# EAGLE design 02_egitim_robotu (EAGLE 9.6.2)
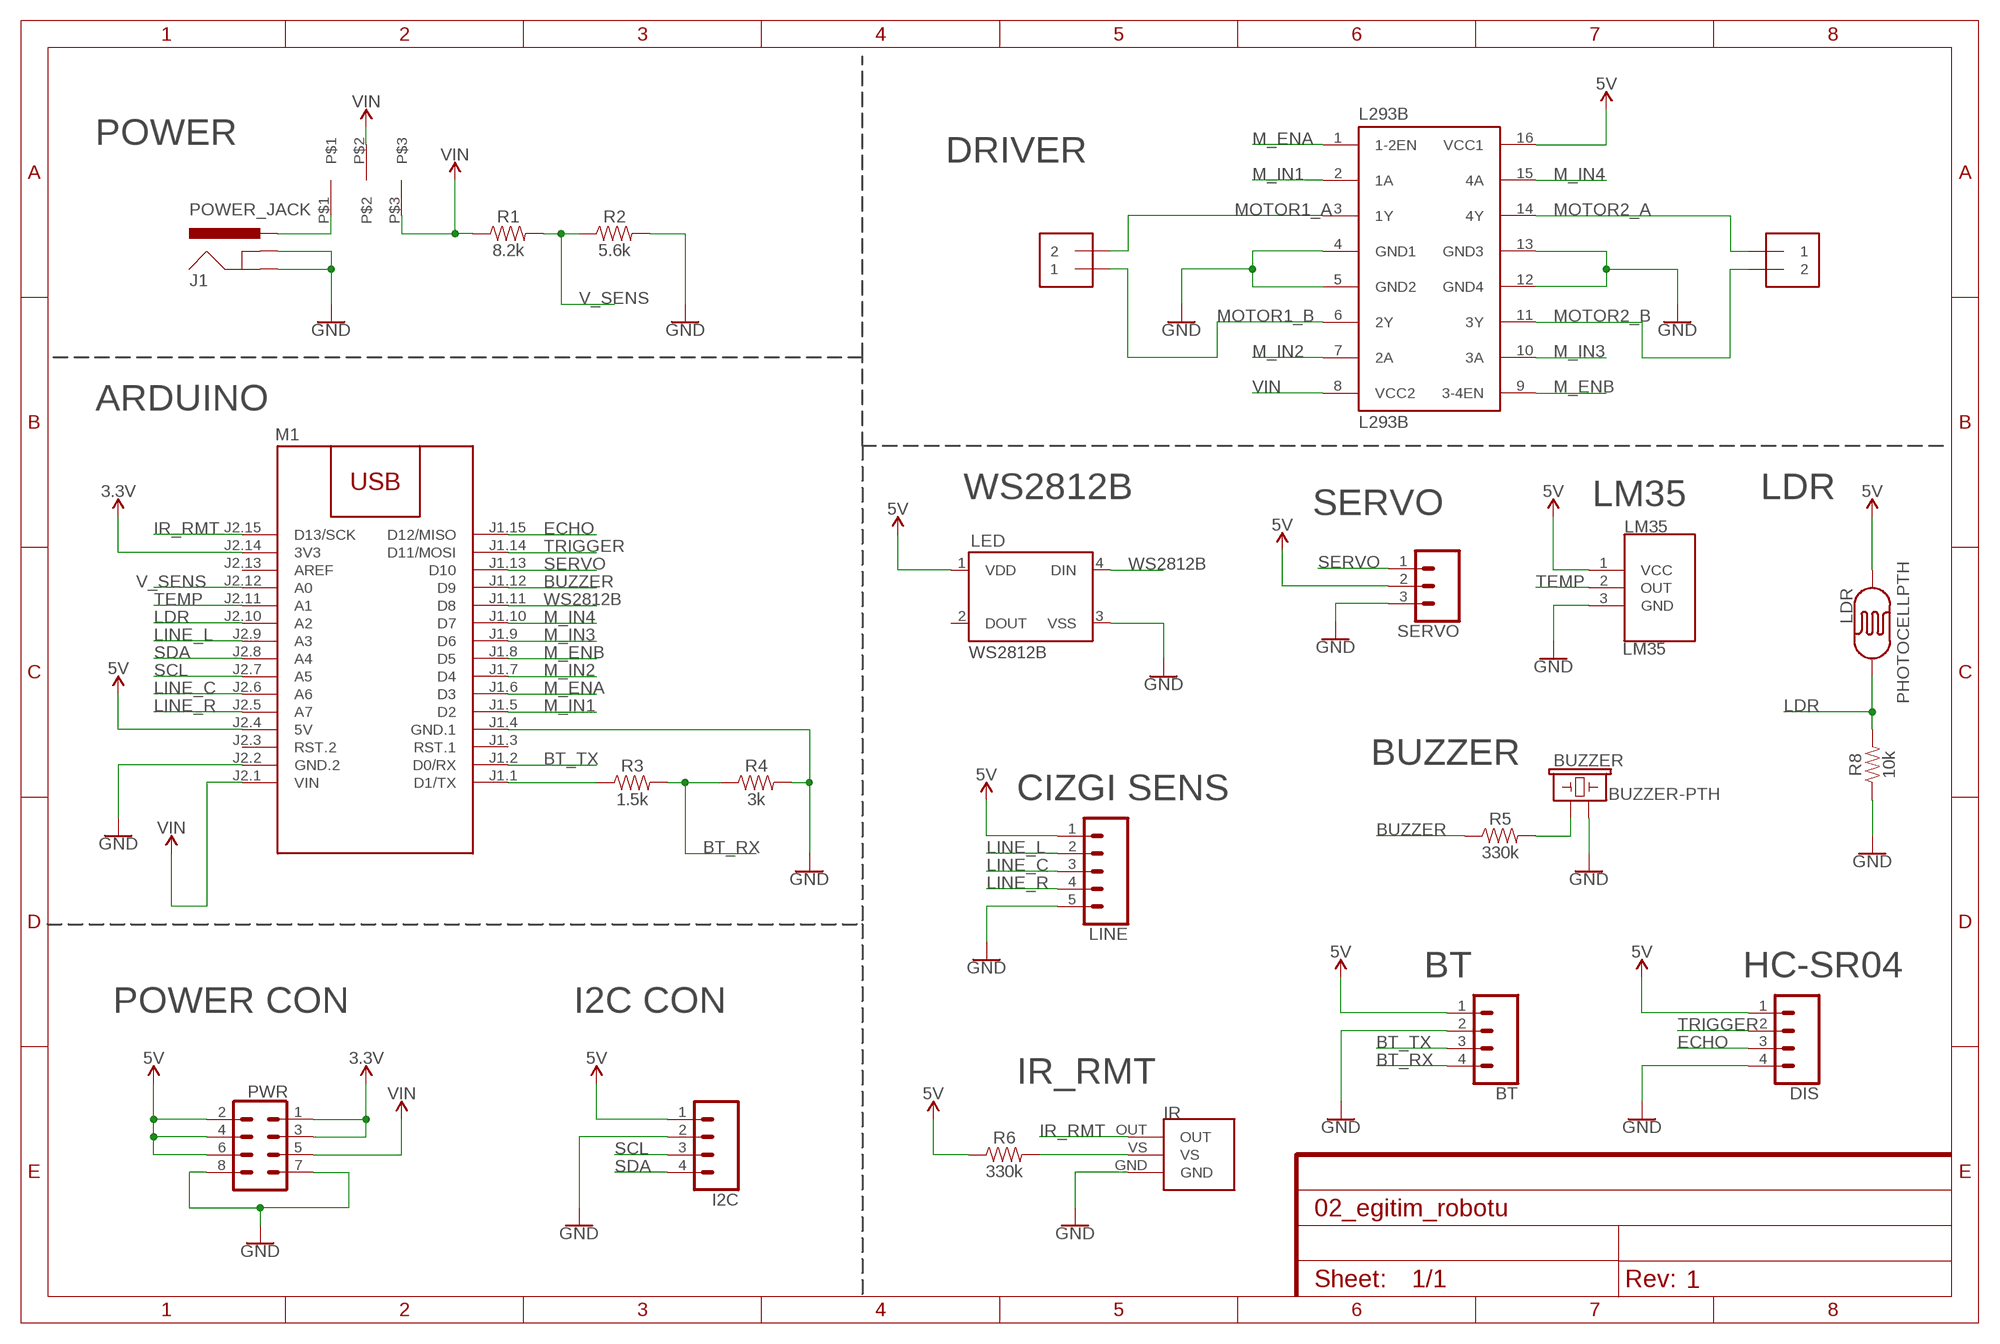
[diagram p0: schematic, sheet 1]
FRAME1 (FRAME-A4L): CREVISION: 1

## Parts
BT  CONN_04  [1X04]
BUZZER  BUZZER-PTH  [BUZZER-12MM]
DIS  CONN_04  [1X04]
I2C  CONN_04  [1X04]
IR  TSOP2238THT  [TSOP2238]
J1  POWER_JACK  [POWER_JACK_PTH]
L293B  L293B  L293D  [DIL16]
LDR  PHOTOCELLPTH  [PHOTOCELL]
LED  WS2812B  [WS2812B]
LINE  CONN_05  [1X05]
LM35  LM35  [TO-92]
M1  ARDUINO-NANO  [ARDUINO-NANO]
MPW1  1X2-3.5MM  [1X2-3.5MM]
MPW2  1X2-3.5MM  [1X2-3.5MM]
PWR  CONN_04X2  [2X4]
R1  8.2k  1KOHM-HORIZ-1/4W-5%  [AXIAL-0.3]
R2  5.6k  1KOHM-HORIZ-1/4W-5%  [AXIAL-0.3]
R3  1.5k  1KOHM-HORIZ-1/4W-5%  [AXIAL-0.3]
R4  3k  1KOHM-HORIZ-1/4W-5%  [AXIAL-0.3]
R5  330k  1KOHM-HORIZ-1/4W-5%  [AXIAL-0.3]
R6  330k  1KOHM-HORIZ-1/4W-5%  [AXIAL-0.3]
R8  10k  1KOHM-HORIZ-1/4W-5%  [AXIAL-0.3]
SERVO  CONN_03  [1X03]
SW1  SURGULU_SIVIC  [SURGULU_SIVIC]

## Nets
3.3V: M1.J2.14(3V3) PWR.1 PWR.3
5V: BT.1 DIS.1 I2C.1 L293B.16(VCC1) LDR.1 LED.1(VDD) LINE.1 LM35.1(VCC) M1.J2.4(5V) PWR.2 PWR.4 PWR.6 R6.P$1 SERVO.2
ARD_TX: M1.J1.1(D1/TX) R3.P$1
BT_RX: BT.4 R3.P$2 R4.P$1
BT_TX: BT.3 M1.J1.2(D0/RX)
BUZZER: M1.J1.12(D9) R5.P$1
ECHO: DIS.3 M1.J1.15(D12/MISO)
GND: BT.2 BUZZER.- DIS.4 I2C.2 IR.GND J1.GND J1.GNDBREAK L293B.4(GND1) L293B.5(GND2) L293B.12(GND4) L293B.13(GND3) LED.3(VSS) LINE.5 LM35.3(GND) M1.J1.4(GND.1) M1.J2.2(GND.2) PWR.7 PWR.8 R2.P$2 R4.P$2 R8.P$1 SERVO.3
IR_RMT: IR.OUT M1.J2.15(D13/SCK)
LDR: LDR.2 M1.J2.10(A2) R8.P$2
LINE_C: LINE.3 M1.J2.6(A6)
LINE_L: LINE.2 M1.J2.9(A3)
LINE_R: LINE.4 M1.J2.5(A7)
M_ENA: L293B.1(1-2EN) M1.J1.6(D3)
M_ENB: L293B.9(3-4EN) M1.J1.8(D5)
M_IN1: L293B.2(1A) M1.J1.5(D2)
M_IN2: L293B.7(2A) M1.J1.7(D4)
M_IN3: L293B.10(3A) M1.J1.9(D6)
M_IN4: L293B.15(4A) M1.J1.10(D7)
MOTOR1_A: L293B.3(1Y) MPW1.2
MOTOR1_B: L293B.6(2Y) MPW1.1
MOTOR2_A: L293B.14(4Y) MPW2.1
MOTOR2_B: L293B.11(3Y) MPW2.2
N$1: BUZZER.+ R5.P$2
N$2: IR.VS R6.P$2
N$3: J1.PWR SW1.P$1
SCL: I2C.3 M1.J2.7(A5)
SDA: I2C.4 M1.J2.8(A4)
SERVO: M1.J1.13(D10) SERVO.1
TEMP: LM35.2(OUT) M1.J2.11(A1)
TRIGGER: DIS.2 M1.J1.14(D11/MOSI)
V_SENS: M1.J2.12(A0) R1.P$2 R2.P$1
VIN: L293B.8(VCC2) M1.J2.1(VIN) PWR.5 R1.P$1 SW1.P$2 SW1.P$3
WS2812B: LED.4(DIN) M1.J1.11(D8)
Unconnected: LED.2(DOUT) M1.J1.3(RST.1) M1.J2.3(RST.2) M1.J2.13(AREF)

## Notes on the sheet
- POWER
- DRIVER
- ARDUINO
- WS2812B | LM35 | LDR
- SERVO
- BUZZER
- CIZGI SENS
- BT | HC-SR04
- POWER CON | I2C CON
- IR_RMT

## Library data of the parts
BT DIS I2C = SparkFun-Connectors:CONN_04: Multi connection point. Often used as Generic Header-pin footprint for 0.1 inch spaced/style header connections On any of the 0.1 inch spaced packages, you can populate with these: Break Away Headers - Straight <https://www.sparkfun.com/products/116> (PRT-00116) Break Away Male Headers - Right Angle <https://www.sparkfun.com/products/553> (PRT-00553) Female Headers <https://www.sparkfun.com/products/115> (PRT-00115) Break Away Headers - Machine Pin <https://www.sparkfun.com/products/117> (PRT-00117) Break Away Female Headers - Swiss Machine Pin <https://www.sparkfun.com/products/743> (PRT-00743) For SCREWTERMINALS and SPRING TERMINALS visit here: Screw Terimnals on SparkFun.com <https://www.sparkfun.com/search/results?term=Screw+Terminals> (5mm/3.5mm/2.54mm spacing) This device is also useful as a general connection point to wire up your design to another part of your project. Our various solder wires solder well into these plated through hole pads. Hook-Up Wire - Assortment (Stranded, 22 AWG) <https://www.sparkfun.com/products/11375> (PRT-11375) Hook-Up Wire - Assortment (Solid Core, 22 AWG) <https://www.sparkfun.com/products/11367> (PRT-11367) View the entire wire category on our website here <https://www.sparkfun.com/categories/141> Special notes: Molex polarized connector foot print use with SKU : PRT-08231 with associated crimp pins and housings. 1MM SMD Version SKU: PRT-10208; PROD_ID: CONN-09696
BUZZER = SparkFun-Electromechanical:BUZZER: Buzzer Small round buzzers that operate around the audible 2kHz range. You can use these as speakers to create simple music or user interfaces. Variant Overview: PTH - Mini Speaker - PC Mount 12mm 2.048kHz <https://www.sparkfun.com/products/7950> PTH_KIT - Mini Speaker - PC Mount 12mm 2.048kHz <https://www.sparkfun.com/products/7950> KIT simplifies soldering by adding stop mask to one side of the pads. PTH_NO_SILK - Mini Speaker - PC Mount 12mm 2.048kHz <https://www.sparkfun.com/products/7950> No silkscreen indicator of buzzer outline. PTH_KIT_NO_SILK - Mini Speaker - PC Mount 12mm 2.048kHz <https://www.sparkfun.com/products/7950> KIT package w/o silkscreen SMD - Buzzer Audio Magnetic (CCV-084B16) SMD buzzer used on, e.g. the LilyPad Buzzer <https://www.sparkfun.com/products/8463> and RFID USB Reader <https://www.sparkfun.com/products/9963>. SMD_KIT - Buzzer Audio Magnetic (CCV-084B16) SMD Buzzer with elongated pins to make soldering easier. Used on the SparkFun Simon Says - Surface Mount Soldering Kit <https://www.sparkfun.com/products/10935>.; PROD_ID: COMP-08253; SF_SKU: COM-07950
IR = OmerFarukUcar-Sensors:TSOP2238: TSOP2238 Device Created Date: 12.02.2020 Datasheet: https://cdn.ozdisan.com/ETicaret_Dosya/38875_1350615.pdf
J1 = SparkFun-Connectors:POWER_JACK: Power Jack Connector This is the standard 5.5mm barrel jack for power. The PTH is the most common, proven, reliable, footprint. The Slot footprint only works if the mill layer is transmitted to the PCB fab house so be warned. Here are the connectors we sell at SparkFun: DC Barrel Power Jack/Connector <https://www.sparkfun.com/products/119> (PRT-00119) DC Barrel Power Jack/Connector (SMD) <https://www.sparkfun.com/products/12748> (PRT-12748) DC Barrel Jack Adapter - Breadboard Compatible <https://www.sparkfun.com/products/10811> (PRT-10811) It is used on this SparkFun product (and many, many others): SparkFun RedBoard - Programmed with Arduino <https://www.sparkfun.com/products/12757> (DEV-12757) Also, if you need a mating power supply or connector, please check these out: Wall Adapter Power Supply - 9VDC 650mA <https://www.sparkfun.com/products/298> (TOL-00298) DC Barrel Jack Adapter - Male <https://www.sparkfun.com/products/10287> (PRT-10287); PROD_ID: CONN-08197
L293B = st-microelectronics:L293D: PUSH-PULL 4 CHANNEL DRIVER; MPN: L293D; OC_FARNELL: 9589619; OC_NEWARK: 56P8249
LDR = SparkFun:PHOTOCELL: Photocell Also known as a CdS photoresistor. This is a low cost way to detect light levels. Resistance decreases with more incoming light. SparkFun SKU: SEN-09088
LED = SparkFun-LED:WS2812B: WS2812B - Intelligent control LED integrated light source Technical Specifications: Power Supply Voltage (VDD): 3.5 to 5.3 V Input Voltage (VI): -0.5 to VDD+0.5 V Operating Junction Temperature (Topt): -25°C to +80°C Storage Temperature Range (Tstg): -55°C to +150°C; PROD_ID: DIO-12503
LINE = SparkFun-Connectors:CONN_05: Multi connection point. Often used as Generic Header-pin footprint for 0.1 inch spaced/style header connections On any of the 0.1 inch spaced packages, you can populate with these: Break Away Headers - Straight <https://www.sparkfun.com/products/116> (PRT-00116) Break Away Male Headers - Right Angle <https://www.sparkfun.com/products/553> (PRT-00553) Female Headers <https://www.sparkfun.com/products/115> (PRT-00115) Break Away Headers - Machine Pin <https://www.sparkfun.com/products/117> (PRT-00117) Break Away Female Headers - Swiss Machine Pin <https://www.sparkfun.com/products/743> (PRT-00743) For SCREWTERMINALS and SPRING TERMINALS visit here: Screw Terimnals on SparkFun.com <https://www.sparkfun.com/search/results?term=Screw+Terminals> (5mm/3.5mm/2.54mm spacing) This device is also useful as a general connection point to wire up your design to another part of your project. Our various solder wires solder well into these plated through hole pads. Hook-Up Wire - Assortment (Stranded, 22 AWG) <https://www.sparkfun.com/products/11375> (PRT-11375) Hook-Up Wire - Assortment (Solid Core, 22 AWG) <https://www.sparkfun.com/products/11367> (PRT-11367) View the entire wire category on our website here <https://www.sparkfun.com/categories/141> Special notes: Molex polarized connector foot print use with SKU : PRT-08231 with associated crimp pins and housings. 1MM SMD Version SKU: PRT-10208
LM35 = ArduinoModelleri:LM35
M1 = OmerFaruk-CPUBoards:ARDUINO-NANO: Arduino Nano 3.0
MPW1 MPW2 = adafruit:1X2: 3.5mm Terminal block http://www.ladyada.net/library/pcb/eaglelibrary.html
PWR = SparkFun-Connectors:CONN_04X2: Multi connection point. Often used as Generic Header-pin footprint for 0.1 inch spaced/style header connections On any of the 0.1 inch spaced packages, you can populate with these: Break Away Headers - Straight <https://www.sparkfun.com/products/116> (PRT-00116) Break Away Male Headers - Right Angle <https://www.sparkfun.com/products/553> (PRT-00553) Female Headers <https://www.sparkfun.com/products/115> (PRT-00115) Break Away Headers - Machine Pin <https://www.sparkfun.com/products/117> (PRT-00117) Break Away Female Headers - Swiss Machine Pin <https://www.sparkfun.com/products/743> (PRT-00743)
R1-R6 R8 = SparkFun-Resistors:1KOHM: 1kΩ resistor A resistor is a passive two-terminal electrical component that implements electrical resistance as a circuit element. Resistors act to reduce current flow, and, at the same time, act to lower voltage levels within circuits. - Wikipedia; PROD_ID: RES-08380; VALUE: 1k
SERVO = SparkFun-Connectors:CONN_03: Multi connection point. Often used as Generic Header-pin footprint for 0.1 inch spaced/style header connections On any of the 0.1 inch spaced packages, you can populate with these: Break Away Headers - Straight <https://www.sparkfun.com/products/116> (PRT-00116) Break Away Male Headers - Right Angle <https://www.sparkfun.com/products/553> (PRT-00553) Female Headers <https://www.sparkfun.com/products/115> (PRT-00115) Break Away Headers - Machine Pin <https://www.sparkfun.com/products/117> (PRT-00117) Break Away Female Headers - Swiss Machine Pin <https://www.sparkfun.com/products/743> (PRT-00743) Stackable Header - 3 Pin (Female, 0.1") <https://www.sparkfun.com/products/13875> (PRT-13875) For SCREWTERMINALS and SPRING TERMINALS visit here: Screw Terimnals on SparkFun.com <https://www.sparkfun.com/search/results?term=Screw+Terminals> (5mm/3.5mm/2.54mm spacing) This device is also useful as a general connection point to wire up your design to another part of your project. Our various solder wires solder well into these plated through hole pads. Hook-Up Wire - Assortment (Stranded, 22 AWG) <https://www.sparkfun.com/products/11375> (PRT-11375) Hook-Up Wire - Assortment (Solid Core, 22 AWG) <https://www.sparkfun.com/products/11367> (PRT-11367) View the entire wire category on our website here <https://www.sparkfun.com/categories/141> Special notes: Molex polarized connector foot print use with SKU : PRT-08232 with associated crimp pins and housings.
SW1 = Komponentler:SURGULU_SIVIC

## Board
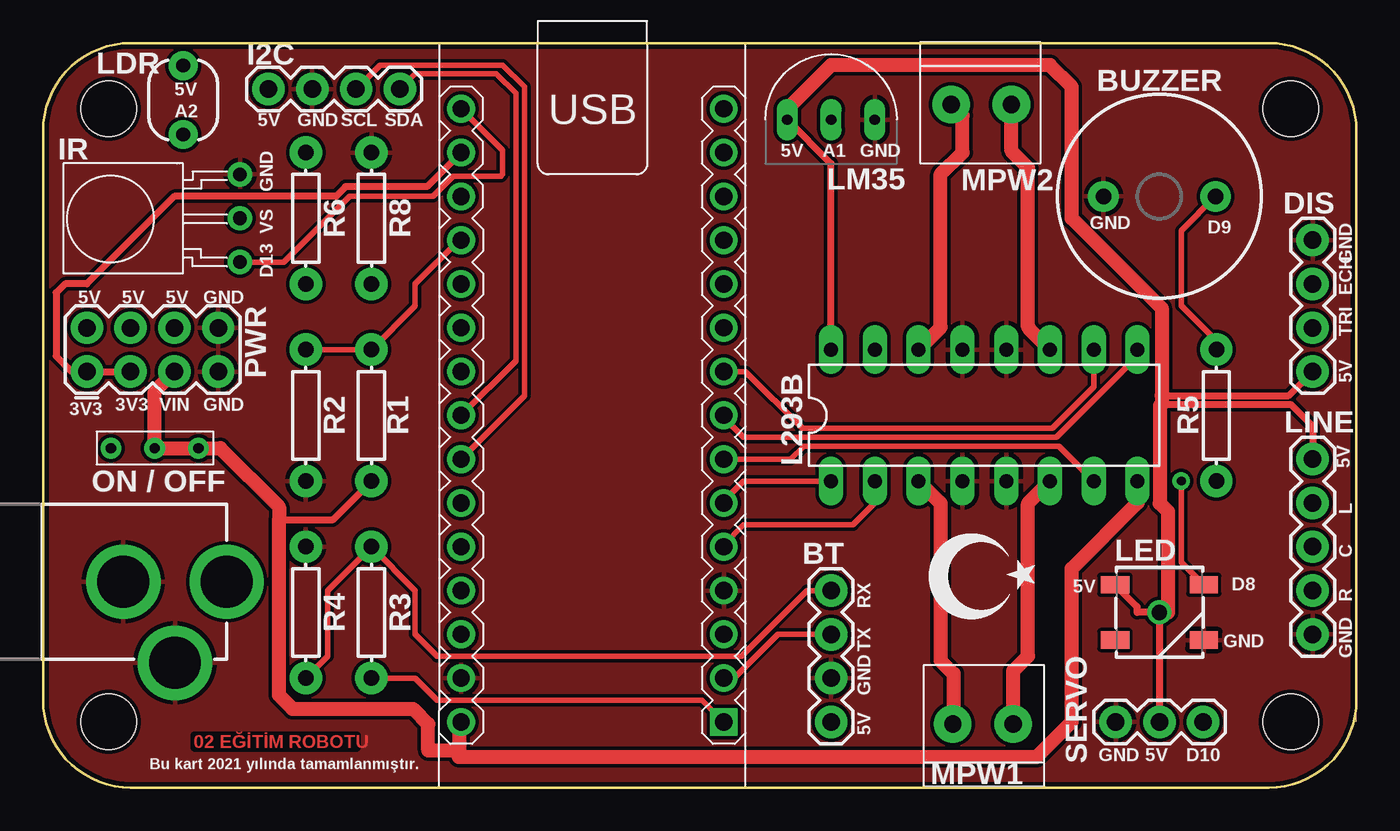
[diagram p1: board, top side]
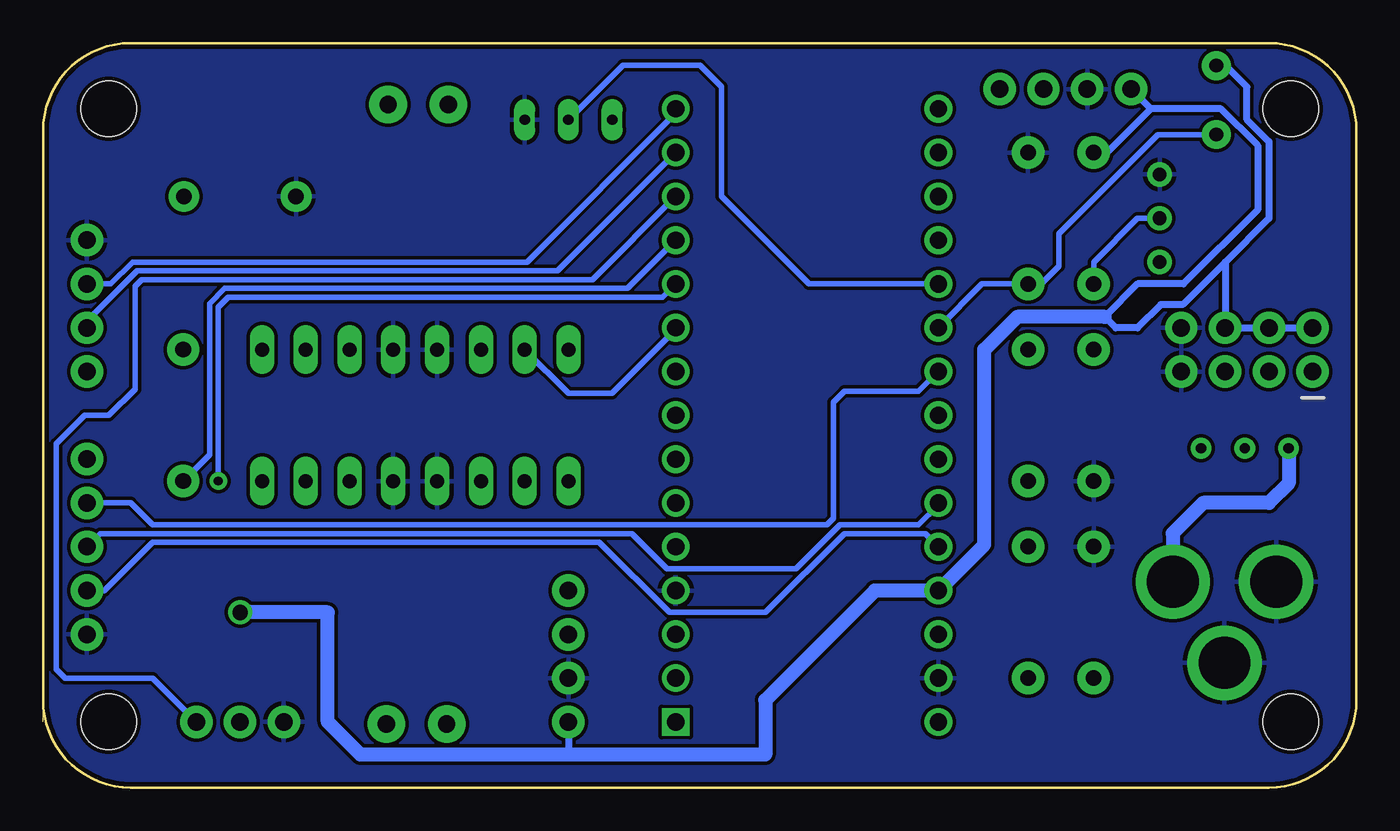
[diagram p2: board, bottom side, seen from below]

Size 76.2 x 43.18 mm. Coordinates in mm from the lower left corner, seen from the top.
Outline: 76.2,38.1 arc90 71.12,43.18
Outline: 5.08,43.18 arc90 0,38.1
Outline: 0,5.08 arc90 5.08,0
Outline: 71.12,0 arc90 76.2,5.08
Outline: 76.2,3.81 76.2,38.1
Outline: 76.2,5.08 76.2,38.1
Outline: 76.2,38.1 arc90 71.12,43.18
Outline: 71.12,43.18 5.08,43.18
Outline: 5.08,43.18 arc90 0,38.1
Outline: 0,38.1 0,5.08
Outline: 0,5.08 arc90 5.08,0
Outline: 5.08,0 71.12,0
Outline: 71.12,0 arc90 76.2,5.08
Copper layers (1*16): Top 0.035mm / dielectric 1.5mm / Bottom 0.035mm
Design rules "SparkFun": minimum track width 8mil, minimum drill 20mil, track to track 8mil, track to pad 8mil, pad to pad 8mil, via to via 8mil, smd to smd 8mil, copper to edge 10mil, drill to drill 8mil, minimum pad ring 12mil, minimum via ring 10mil, stop-mask expansion 4mil, vias tented up to drill 25mil, thermal gap 10mil
Holes 3.2 mm at 3.81,39.37 3.81,3.81 72.39,3.81 72.39,39.37

### Footprints (pad centres in the part's own frame; a part is rotated, then mirrored left to right if it is on the bottom)
1X04 = drill 1.016 pad 1.88: 1 0,0; 2 2.54,0; 3 5.08,0; 4 7.62,0
BUZZER-12MM = drill 0.9 pad 1.778: + 3.25,0; - -3.25,0
TSOP2238 = drill 0.8: GND 2.54,-7.61; OUT -2.54,-7.61; VS 0,-7.61
POWER_JACK_PTH = drill 2.997 pad 4.318: GND 0,7.7; GNDBREAK 4.7,10.7; PWR 0,13.7
DIL16 = drill 0.813 long: 1 -8.89,-3.81; 2 -6.35,-3.81; 3 -3.81,-3.81; 4 -1.27,-3.81; 5 1.27,-3.81; 6 3.81,-3.81; 7 6.35,-3.81; 8 8.89,-3.81; 9 8.89,3.81; 10 6.35,3.81; 11 3.81,3.81; 12 1.27,3.81; 13 -1.27,3.81; 14 -3.81,3.81; 15 -6.35,3.81; 16 -8.89,3.81
PHOTOCELL = drill 0.8 pad 1.676: 1 -2,0; 2 2,0
WS2812B = smd 1.651 x 1: 1 -2.577,1.6; 2 -2.577,-1.6; 3 2.577,-1.6; 4 2.577,1.6
1X05 = drill 1.016 pad 1.88: 1 0,0; 2 2.54,0; 3 5.08,0; 4 7.62,0; 5 10.16,0
TO-92 = drill 0.6 long: 1 1.27,0; 2 3.81,0; 3 6.35,0
ARDUINO-NANO = drill 1 square: J1.1 17.78,7.62 | drill 1: J1.2 15.24,7.62; J1.3 12.7,7.62; J1.4 10.16,7.62; J1.5 7.62,7.62; J1.6 5.08,7.62; J1.7 2.54,7.62; J1.8 0,7.62; J1.9 -2.54,7.62; J1.10 -5.08,7.62; J1.11 -7.62,7.62; J1.12 -10.16,7.62; J1.13 -12.7,7.62; J1.14 -15.24,7.62; J1.15 -17.78,7.62; J2.1 17.78,-7.62; J2.2 15.24,-7.62; J2.3 12.7,-7.62; J2.4 10.16,-7.62; J2.5 7.62,-7.62; J2.6 5.08,-7.62; J2.7 2.54,-7.62; J2.8 0,-7.62; J2.9 -2.54,-7.62; J2.10 -5.08,-7.62; J2.11 -7.62,-7.62; J2.12 -10.16,-7.62; J2.13 -12.7,-7.62; J2.14 -15.24,-7.62; J2.15 -17.78,-7.62
1X2-3.5MM = drill 1 pad 2.184: 1 1.8,0; 2 -1.7,0
2X4 = drill 1.016 pad 1.88: 1 -3.81,-1.27; 2 -3.81,1.27; 3 -1.27,-1.27; 4 -1.27,1.27; 5 1.27,-1.27; 6 1.27,1.27; 7 3.81,-1.27; 8 3.81,1.27
AXIAL-0.3 = drill 0.9 pad 1.88: P$1 -3.81,0; P$2 3.81,0
1X03 = drill 1.016 pad 1.88: 1 0,0; 2 2.54,0; 3 5.08,0
SURGULU_SIVIC = drill 0.6: P$1 -10.16,2.54; P$2 -7.62,2.54; P$3 -5.08,2.54

### Placement (x,y rotation side)
BT  45.72,3.81 90 top
BUZZER  64.77,34.29 0 top
DIS  73.66,24.13 90 top
I2C  13.08,40.51 0 top
IR  3.81,33.02 90 top
J1  -3.05,11.94 270 top
L293B  54.61,21.59 0 top
LDR  8.13,39.88 270 top
LED  64.77,10.16 0 top
LINE  73.66,19.05 270 top
LM35  41.91,38.73 0 top
M1  31.88,21.59 270 top
MPW1  54.48,3.68 0 top
MPW2  54.48,39.62 180 top
PWR  6.35,25.4 0 top
R1  19.05,21.59 90 top
R2  15.24,21.59 270 top
R3  19.05,10.16 90 top
R4  15.24,10.16 90 top
R5  68.07,21.59 90 top
R6  15.24,33.02 270 top
R8  19.05,33.02 270 top
SERVO  67.31,3.81 180 top
SW1  14.1,17.14 0 top
U$9  [TR_MINI]  50.21,9.21 0 top

### Tracks (layer width: path | path; a pad name or v marks a point on that pad's centre or on a via)
3.3V
  Top 0.406: M1.J2.14 22.28,34.85 17.55,34.85 16.99,34.29 7.62,34.29 2.54,29.21 1.27,29.21 0.76,28.7 0.76,25.02 1.65,24.13 PWR.1 PWR.3
5V  (via drill 0.89)
  Top 0.406: LED.1 63.46,10.49 63.46,10.16 v64.77,10.16 SERVO.2 | L293B.16 45.72,36.2 LM35.1 | LINE.1 73.66,20.96 72.39,22.23 64.9,22.23 | 64.9,22.73 72.26,22.73 DIS.1
  Top 0.813: 64.9,10.16 v64.77,10.16 65.28,10.16 65.28,16 64.79,16.49 64.82,16.52 64.82,22.15 64.9,22.23 64.9,22.73 64.9,27.81 59.69,33.02 59.69,40.64 58.42,41.91 45.72,41.91 43.18,39.37 LM35.1
  Bottom 0.406: BT.1 45.72,1.9 | LDR.1 7.59,41.88 6.35,40.64 6.35,38.73 5.08,37.46 5.08,33.02 7.62,30.48 | I2C.1 11.94,39.37 | 11.94,39.37 7.86,39.37 5.73,37.24 5.73,33.51 10.03,29.21 12.7,29.21 14.6,27.3 13.97,26.67 12.7,26.67 11.35,28.02 10.08,28.02 7.62,30.48 | 11.94,39.37 14.48,36.83 R6.P$1 | 7.62,30.48 PWR.6 PWR.4 PWR.2
  Bottom 0.813: v64.77,10.16 59.69,10.16 59.69,3.81 57.79,1.9 45.72,1.9 34.29,1.9 34.29,5.08 27.94,11.43 M1.J2.4 21.59,14.1 21.59,25.4 19.68,27.3 14.6,27.3
ARD_TX
  Top 0.305: R3.P$1 21.59,6.35 22.86,5.08 38.23,5.08 M1.J1.1
BT_RX
  Top 0.305: R4.P$1 16.51,7.62 16.51,11.43 R3.P$2 21.59,11.43 21.59,8.89 22.86,7.62 40.51,7.62 44.32,11.43 BT.4
BT_TX
  Top 0.305: M1.J1.2 40.09,6.35 42.63,8.89 BT.3
BUZZER
  Bottom 0.305: R5.P$1 66.55,19.3 66.55,28.07 65.66,28.96 42.29,28.96 M1.J1.12
ECHO
  Bottom 0.305: DIS.3 72.26,29.21 70.99,30.48 48.13,30.48 39.5,39.12 M1.J1.15
GND
  pour Top: -3.81,45.72 -3.81,-2.54 78.74,-2.54 78.74,0 78.74,45.72
  pour Bottom: -6.35,48.26 -6.35,-5.08 81.28,-5.08 81.28,48.26
IR_RMT
  Top 0.305: IR.OUT 13.97,30.48 17.78,34.29 22.62,34.29 23.78,35.45 26.56,35.45 26.67,35.56 26.67,36.96 M1.J2.15
LDR
  Bottom 0.305: M1.J2.10 21.72,29.21 R8.P$2 18.29,29.21 17.27,30.23 17.27,32.13 11.52,37.88 LDR.2
LINE_C
  Bottom 0.305: LINE.3 72.9,14.73 42.03,14.73 39.99,12.7 32.51,12.7 29.97,15.24 25.4,15.24 24.26,16.38 M1.J2.6
LINE_L
  Bottom 0.305: LINE.2 71.12,16.51 69.85,15.24 30.73,15.24 30.35,15.62 30.35,22.35 29.72,22.99 25.4,22.99 M1.J2.9
LINE_R
  Bottom 0.305: LINE.4 72.64,11.43 69.85,14.22 43.93,14.22 39.87,10.16 34.29,10.16 29.72,14.73 25.02,14.73 M1.J2.5
M_ENA
  Top 0.305: L293B.1 40.64,17.78 39.5,16.64 M1.J1.6
M_ENB
  Top 0.305: L293B.9 63.5,25.02 58.8,20.32 40.64,20.32 39.5,21.46 M1.J1.8
M_IN1
  Top 0.305: L293B.2 48.26,16.51 46.99,15.24 45.72,15.24 | 45.72,15.24 40.64,15.24 39.5,14.1 M1.J1.5 | 45.72,15.24
M_IN2
  Top 0.305: M1.J1.7 43.37,19.05 44.13,19.81 58.93,19.81 L293B.7
M_IN3
  Top 0.305: L293B.10 60.96,23.24 58.55,20.83 44.07,20.83 40.77,24.13 M1.J1.9
M_IN4
  Bottom 0.305: M1.J1.10 39.5,26.54 43.18,22.86 45.72,22.86 L293B.15
MOTOR1_A
  Top 0.813: L293B.3 52.02,16.56 52.02,16.52 52.07,16.47 52.07,7.37 52.83,6.6 52.83,3.73 MPW1.2
MOTOR1_B
  Top 0.813: MPW1.1 56.28,6.75 57.15,7.62 57.15,16.47 57.2,16.52 57.2,16.56 L293B.6
MOTOR2_A
  Top 0.813: L293B.14 52.02,26.62 52.02,26.66 52.05,26.69 52.07,26.71 52.07,35.56 53.34,36.83 53.34,38.97 MPW2.1
MOTOR2_B
  Top 0.813: L293B.11 57.2,26.62 57.2,26.66 57.15,26.71 57.15,35.94 56.18,36.91 MPW2.2
N$1
  Top 0.305: BUZZER.+ 66.04,32.31 66.04,27.94 67.94,26.04
  Top 0.406: 67.94,26.04 68.07,26.04 R5.P$2
N$2
  Bottom 0.305: IR.VS 12.7,33.02 15.24,30.48 R6.P$2
N$3
  Bottom 0.813: SW1.P$1 3.94,17.65 5.08,16.51 8.89,16.51 10.65,14.75 J1.PWR
SCL
  Top 0.305: M1.J2.7 27.94,22.73 27.94,40.64 26.67,41.91 19.56,41.91 I2C.3
SDA
  Top 0.305: M1.J2.8 27.43,24.77 27.43,40.26 26.29,41.4 21.59,41.4 I2C.4
SERVO
  Bottom 0.305: SERVO.1 69.85,6.35 74.93,6.35 75.44,6.86 75.44,19.94 73.79,21.59 72.39,21.59 70.87,23.11 70.87,29.08 70.49,29.46 44.32,29.46 M1.J1.13
TEMP
  Bottom 0.305: M1.J2.11 31.75,29.21 36.83,34.29 36.83,40.64 38.1,41.91 42.54,41.91 LM35.2
TRIGGER
  Bottom 0.305: DIS.2 73.66,27.05 70.74,29.97 46.35,29.97 M1.J1.14
V_SENS
  Top 0.305: R2.P$1 R1.P$2 21.59,27.94 21.59,29.21 24.13,31.75 M1.J2.12
VIN
  Top 0.406: R1.P$1 16.79,15.52 13.69,15.52
  Top 0.813: L293B.8 63.5,16.51 59.69,12.7 59.69,3.81 57.66,1.78 24.13,1.78 24.13,2.16 | 24.13,2.16 22.35,2.16 22.35,3.68 21.46,4.57 14.48,4.57 13.69,5.36 13.69,15.52 13.69,16.28 10.29,19.68 SW1.P$3 SW1.P$2 6.48,22.99 PWR.5 | M1.J2.1 24.13,3.68 24.13,2.16
WS2812B  (via drill 0.51)
  Top 0.305: LED.4 66.04,13.07 v66.04,17.78
  Bottom 0.305: v66.04,17.78 66.04,27.86 65.45,28.45 40.26,28.45 M1.J1.11

### Text on the board
Top: 02 EĞİTİM ROBOTU
tPlace: Bu kart 2021 yılında tamamlanmıştır.
tNames: 5V | A2 | 5V | GND | SCL | SDA | 5V | A1 | GND | GND | GND | D9 | GND | VS | D13 | ECH | 5V | 5V | 5V | GND | TRI | 5V | 3V3 | 3V3 | VIN | GND | 5V | ON / OFF | L | C | 5V | D8 | RX | R | GND | TX | GND | GND | 5V | 5V | D10 | GND
tStop: 02 EĞİTİM ROBOTU